# EasyEDA Pro project ProProject_个人时钟天气站_练习用_2024-06-15.epro

# Schematic 超漂亮的个人时钟天气站_备课

## Sheets
1 LCD_AND_MCU
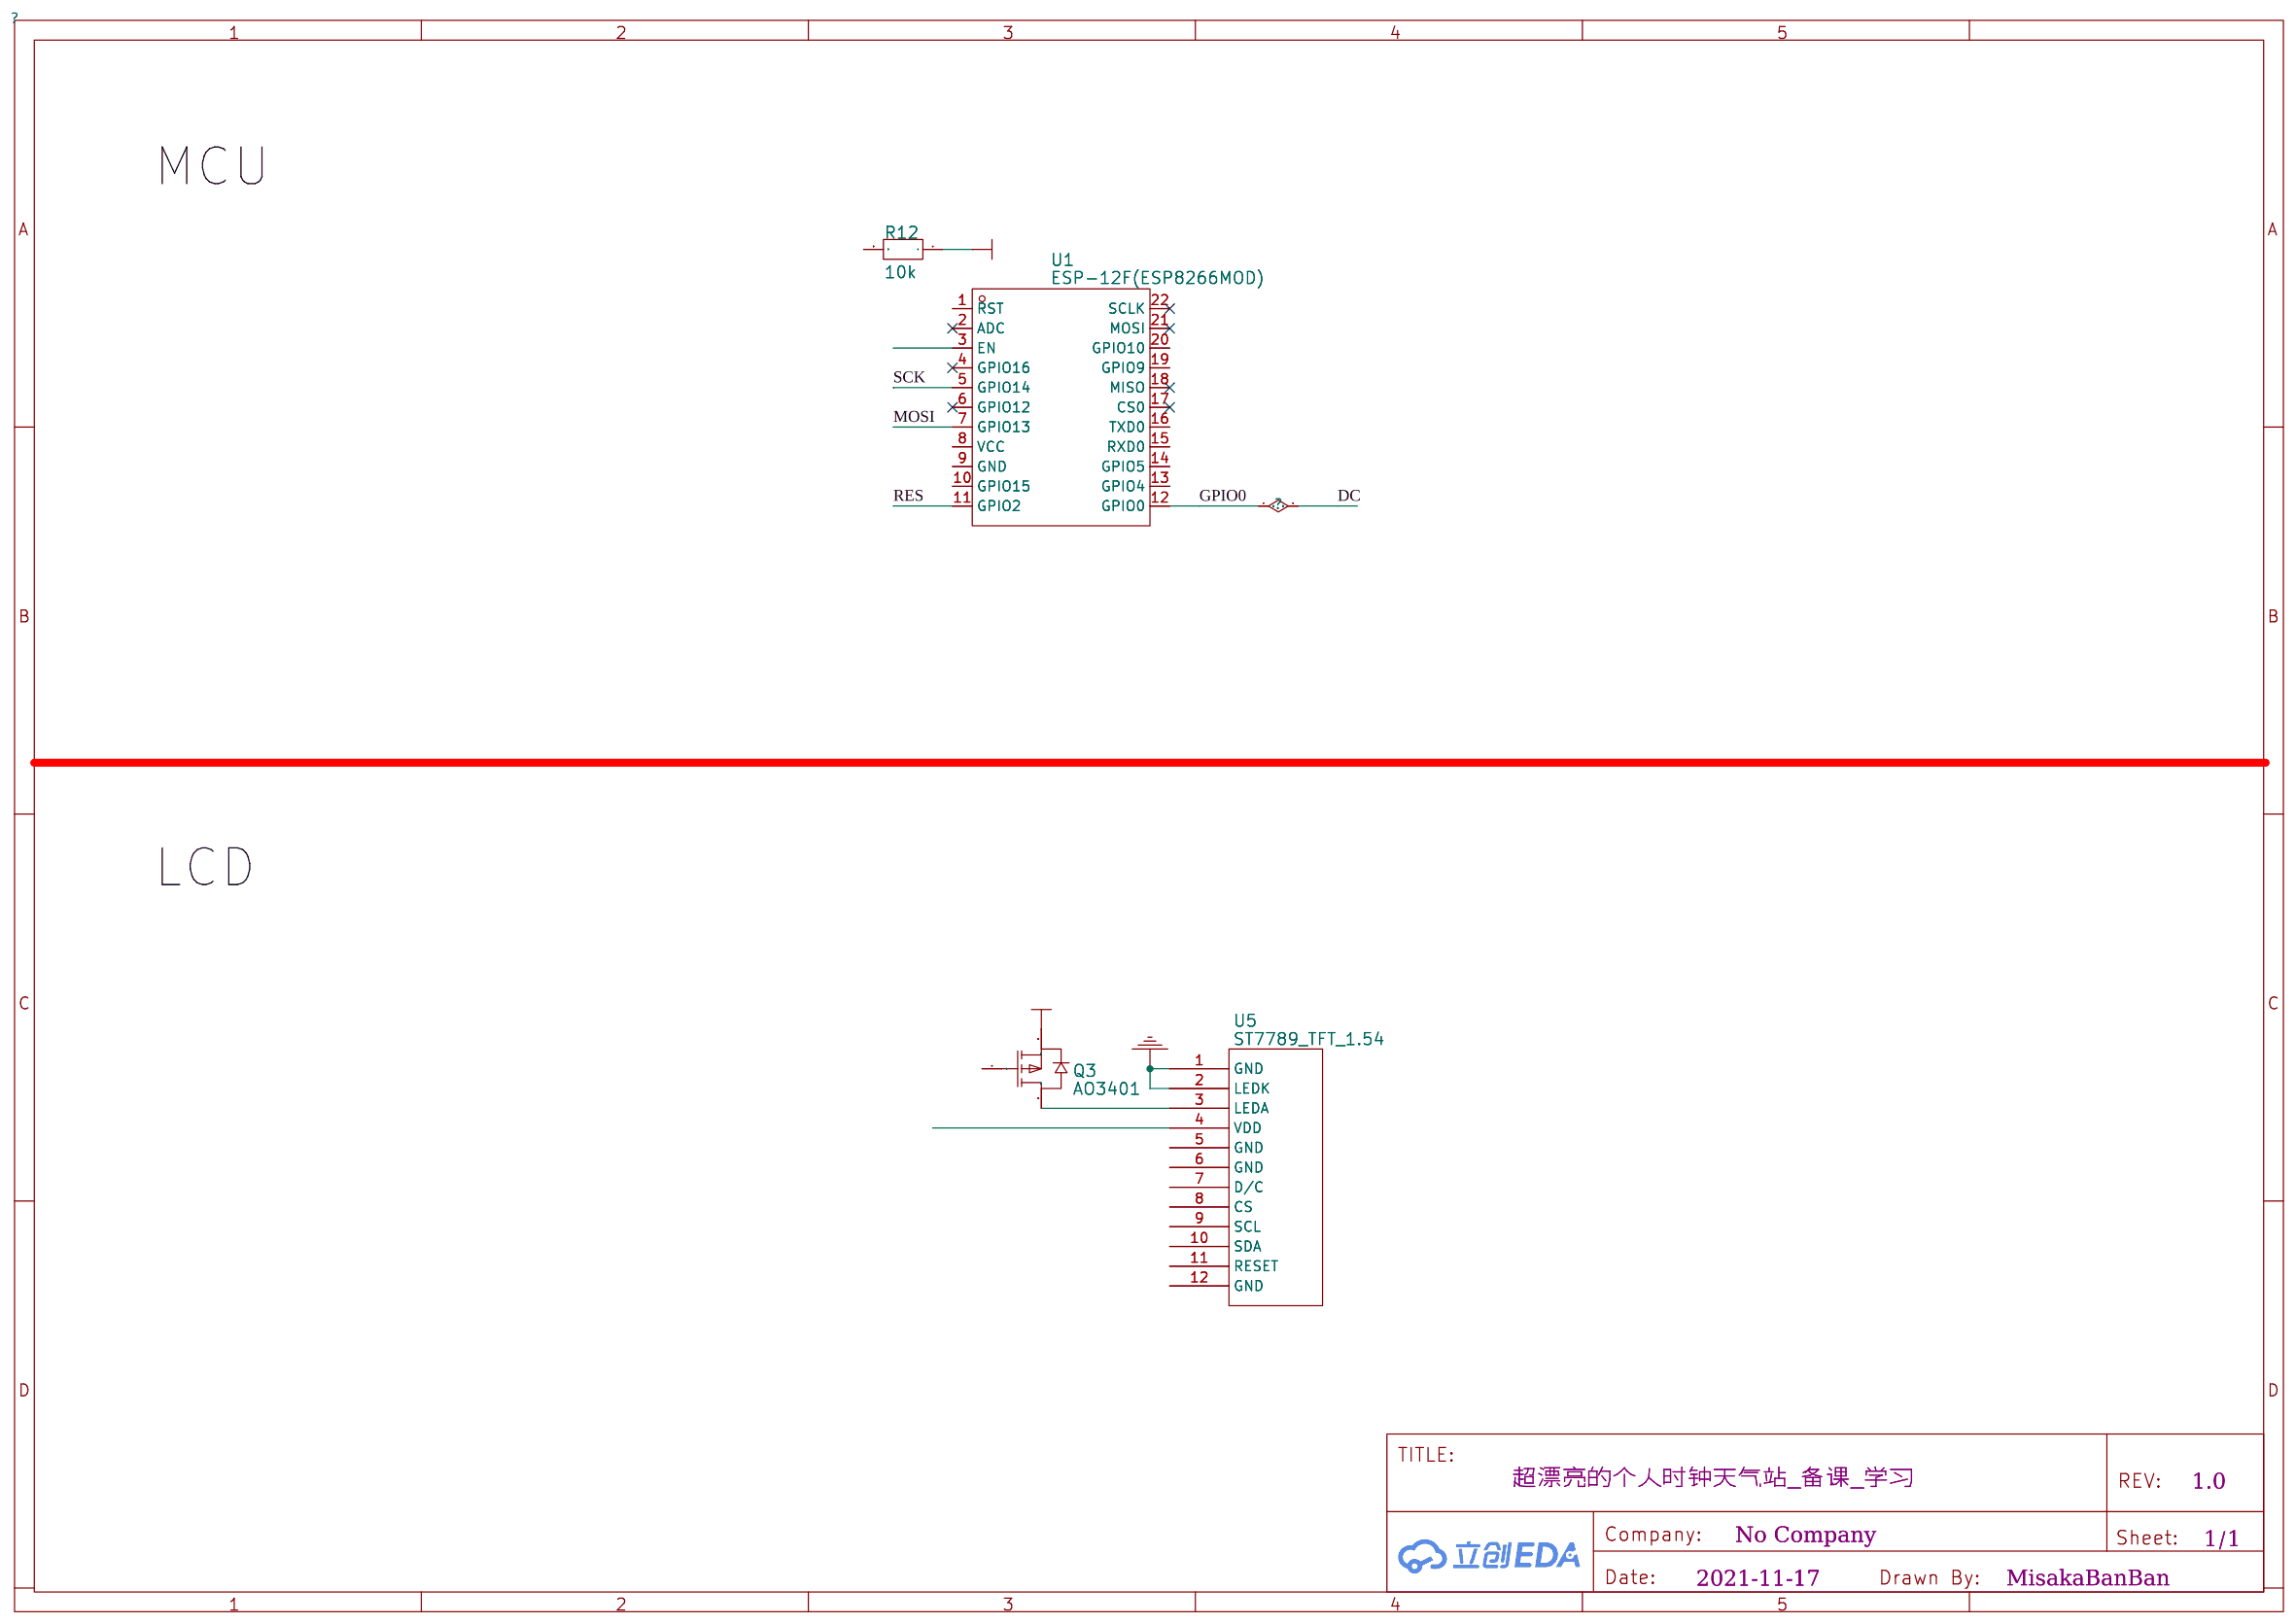
[diagram p0: LCD_AND_MCU]
2 USB_TO_UART
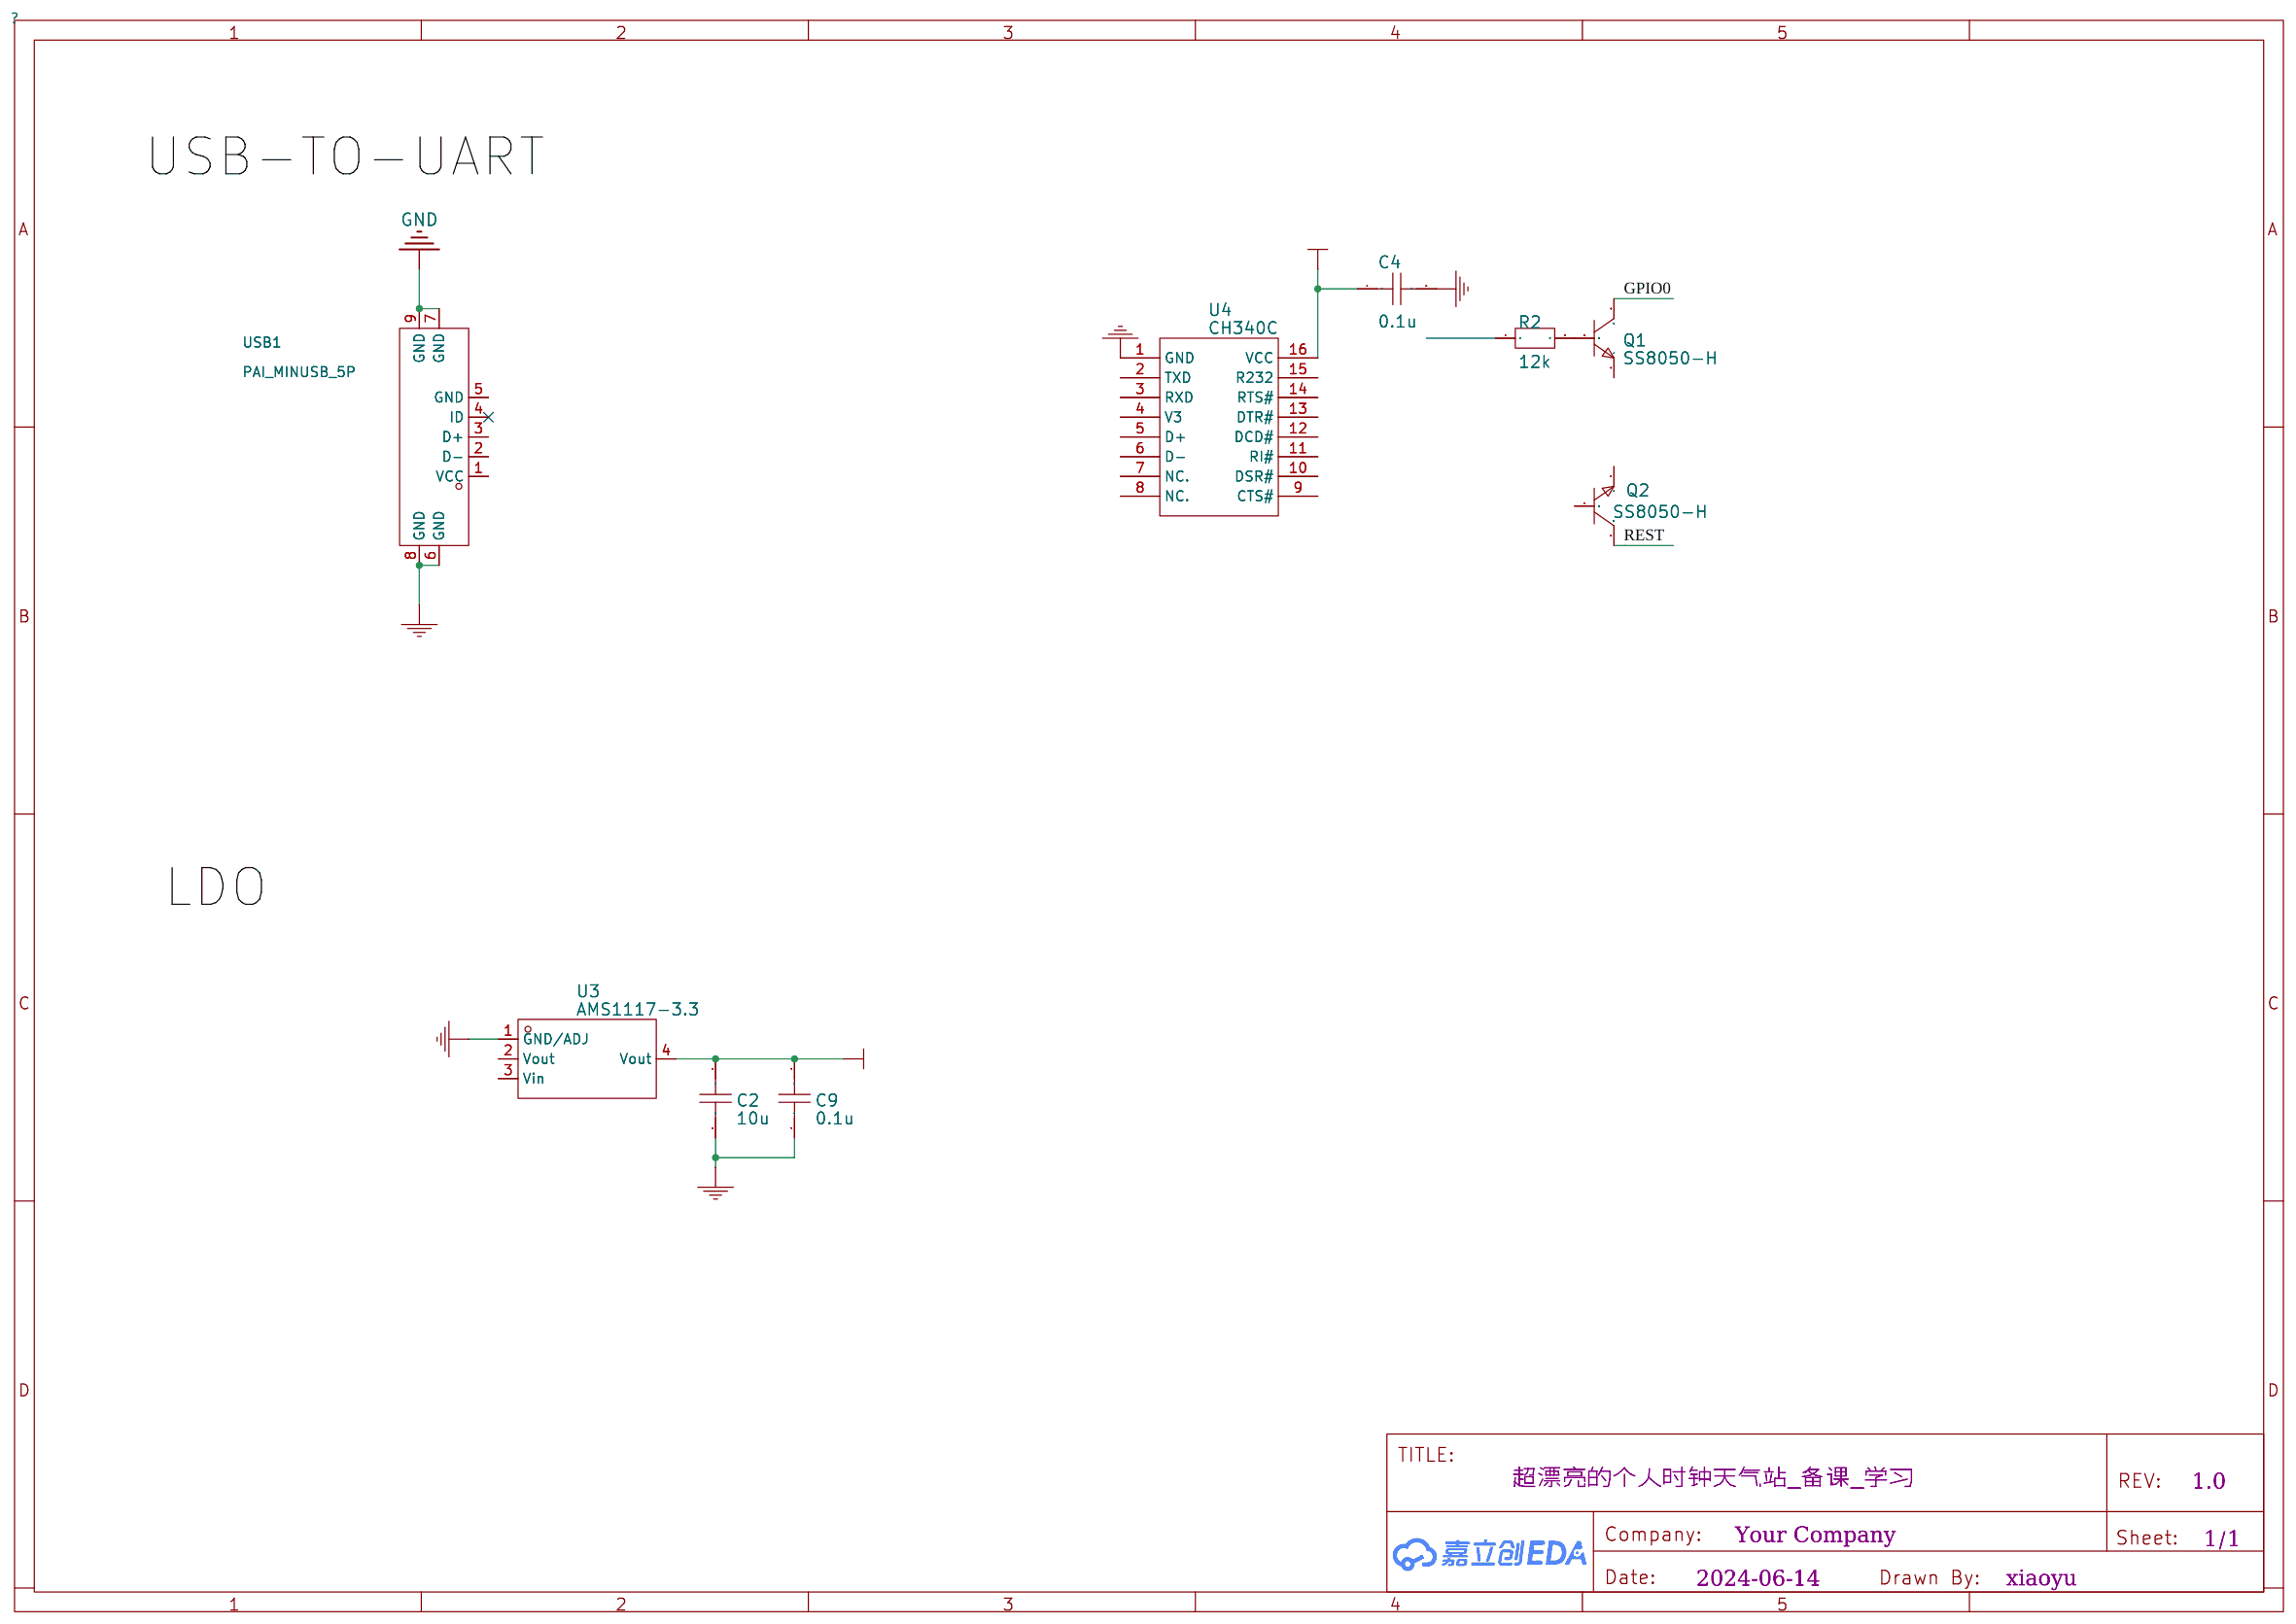
[diagram p1: USB_TO_UART]
3 Sheet_Structure
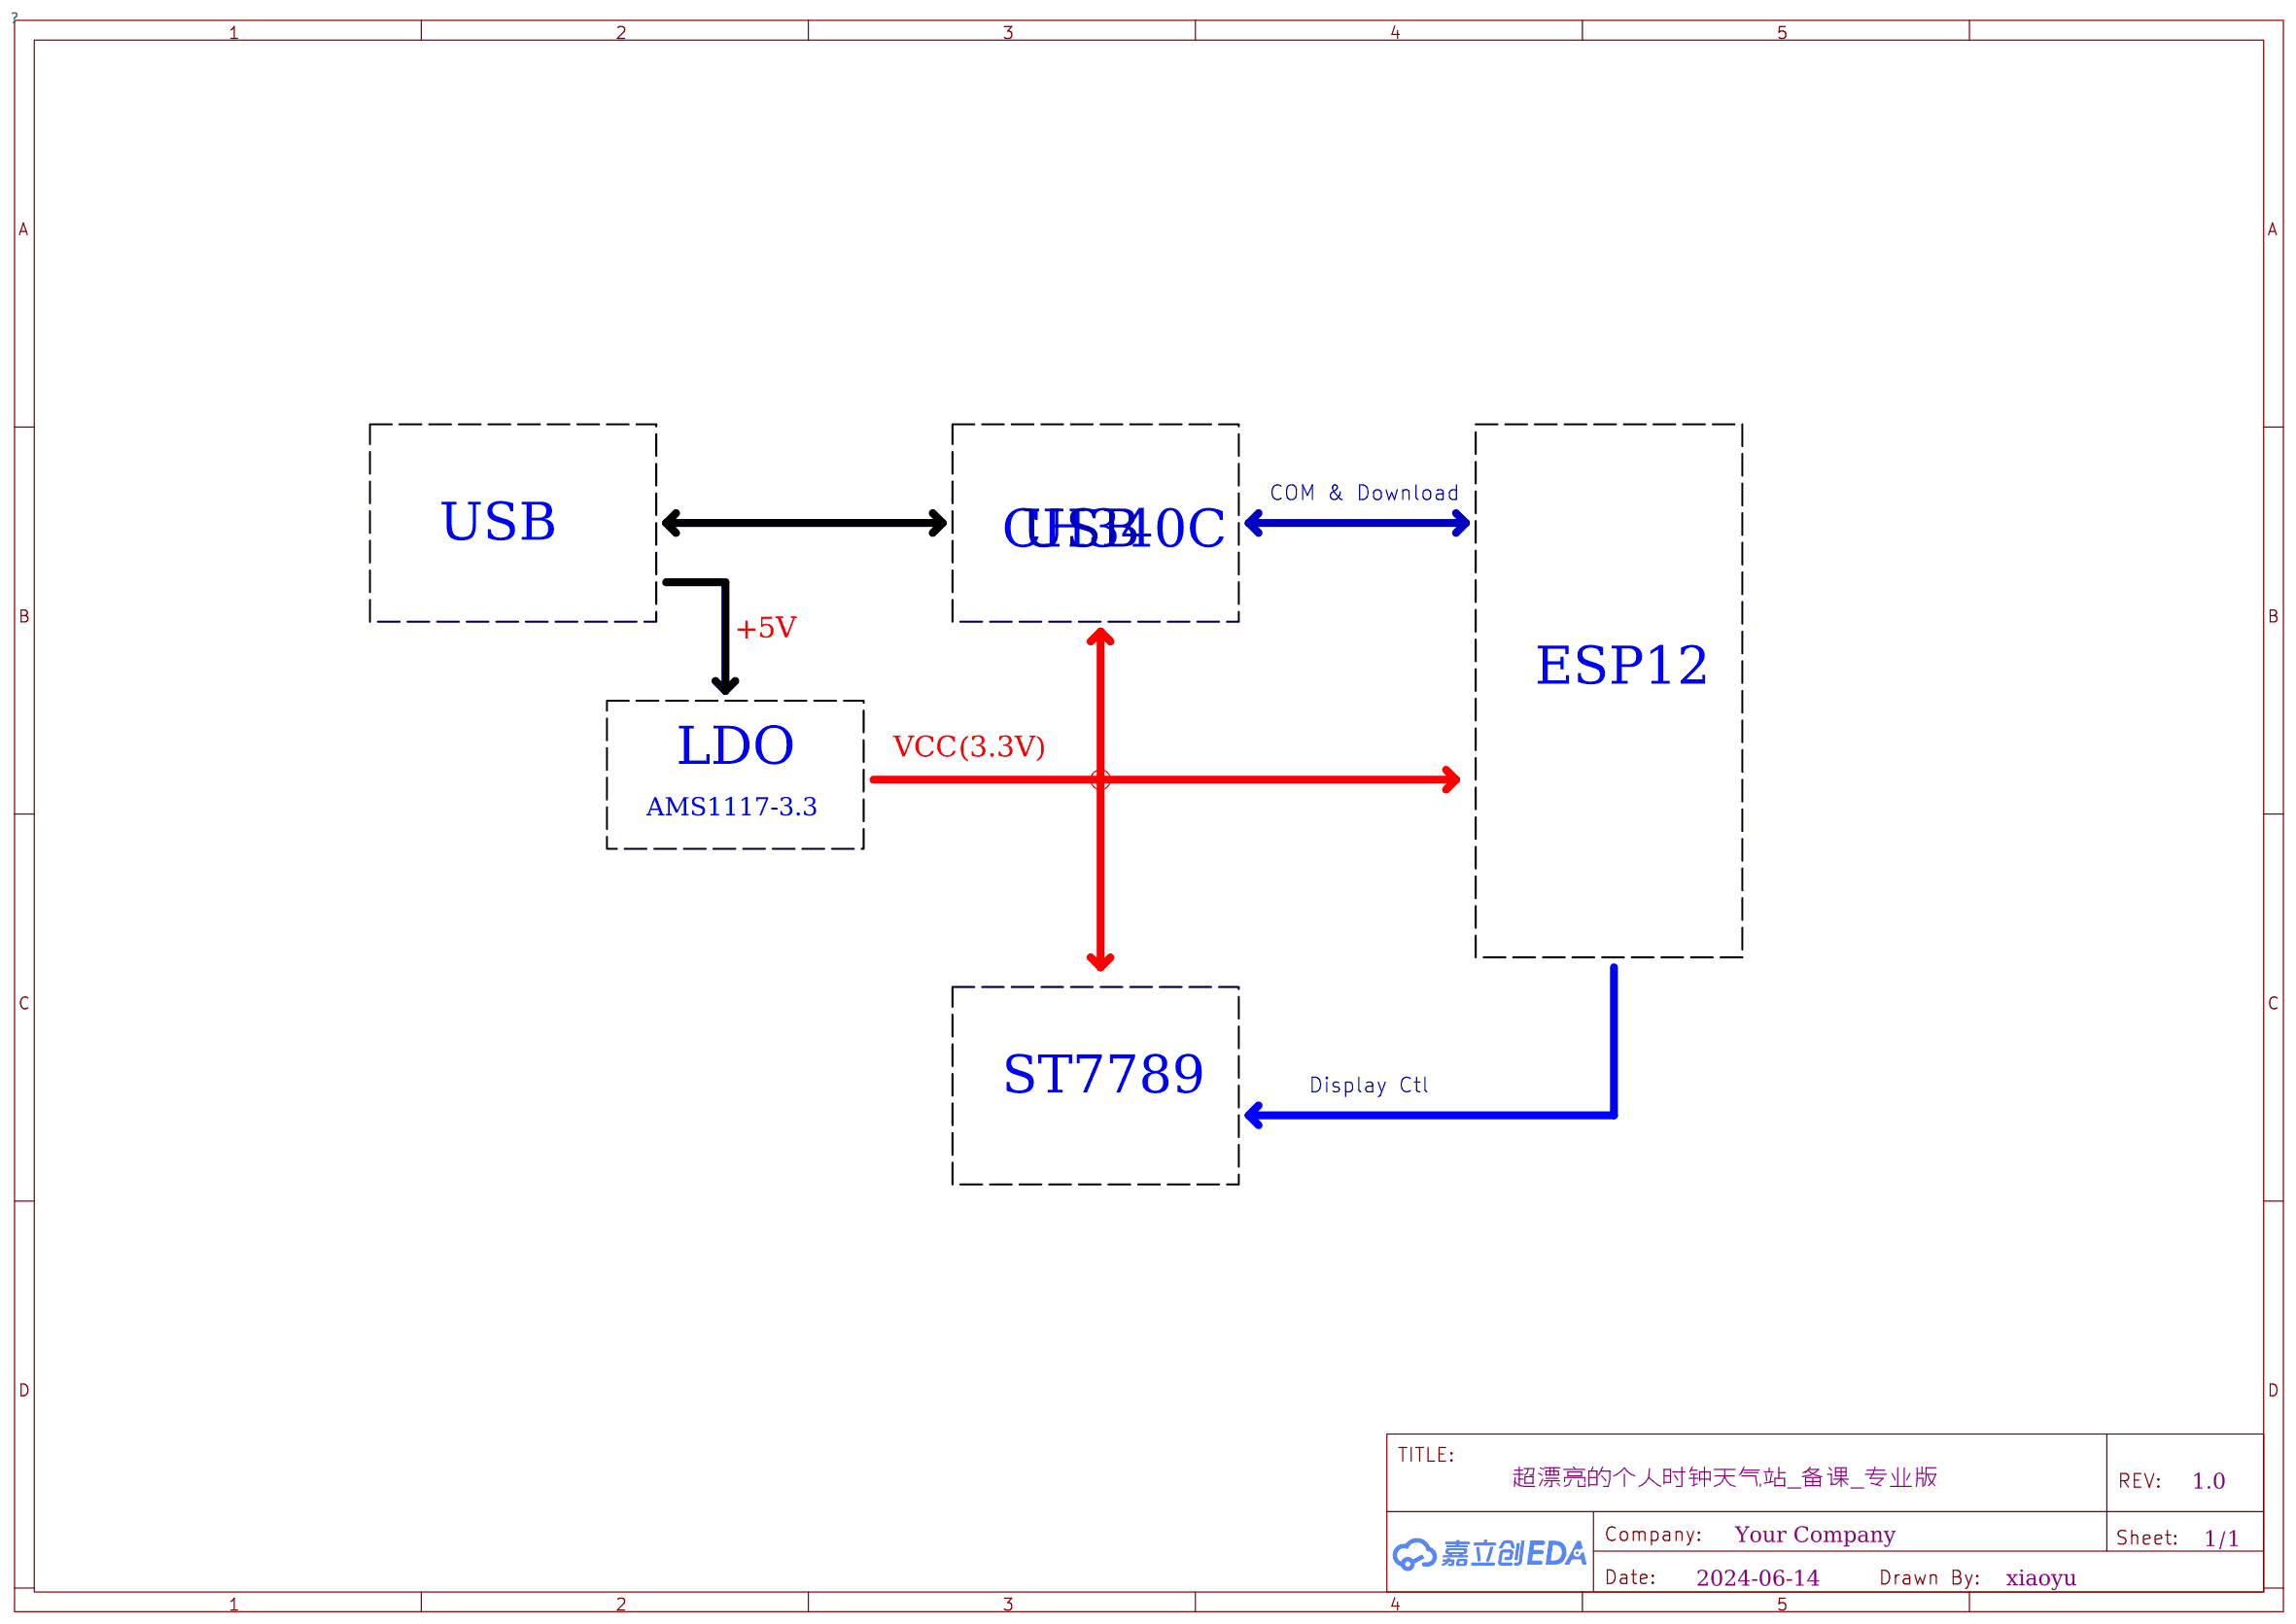
[diagram p2: Sheet_Structure]

## Parts
sheet LCD_AND_MCU
Q3  AO3401  [AO3401]
R12  10k  [R0603]
U1  ESP-12F(ESP8266MOD)  [WIFIM-SMD_ESP-12F-ESP8266MOD]
U5  ST7789_TFT_1.54  [ST7789_TFT_1.54]
sheet USB_TO_UART
C2  10u  [C0603]
C4  0.1u  [C0603]
C9  0.1u  [C0603]
Q1  SS8050-H  [SOT-23-3_L2.9-W1.3-P1.90-LS2.4-BR]
Q2  SS8050-H  [SOT-23-3_L2.9-W1.3-P1.90-LS2.4-BR]
R2  12k  [R0603]
U3  AMS1117-3.3  [SOT-223-3_L6.5-W3.4-P2.30-LS7.0-BR]
U4  CH340C  [SOP-16_L10.0-W3.9-P1.27-LS6.0-BL]
USB1  PAI_MINUSB_5P  [MINI-USB-SMD_PAI_MINUSB_5P]

## Library data of the parts
Q3 = AO3401: Manufacturer: LGE; Supplier: LCSC; Supplier Part: C688915; link: https://item.szlcsc.com/14454.html
R2 R12 = 12k
U1 = ESP-12F(ESP8266MOD): Supplier: LCSC; Manufacturer: Ai-Thinker; Supplier Part: C82891; JLCPCB Part Class: Extended Part
U5 = ST7789_TFT_1.54
C2 = 10u
C4 C9 = 0.1u
Q1 Q2 = SS8050-H: Supplier: LCSC; Supplier Part: C699255; Manufacturer: Yangzhou Yangjie Elec Tech; JLCPCB Part Class: Extended Part
U3 = AMS1117-3.3: Supplier: LCSC; Manufacturer: AMS; Supplier Part: C6186; JLCPCB Part Class: Basic Part
U4 = CH340C: Supplier: LCSC; Manufacturer: WCH; Supplier Part: C84681; JLCPCB Part Class: Extended Part
USB1 = PAI_MINUSB_5P: Supplier Part: C2889293; Supplier Footprint: USB-SMD_5P; JLCPCB Part Class: 扩展库; Supplier: LCSC

## Nets
GND: C2.2 C4.2 C9.2 U3.1(GND/ADJ) U4.1(GND) U5.1(GND) U5.2(LEDK) USB1.6(GND) USB1.7(GND) USB1.8(GND) USB1.9(GND)
VCC: C2.1 C4.1 C9.1 Q3.2(S) R12.1 U3.4(Vout) U4.16(VCC)
DC: Q1.3(C) U1.12(GPIO0)
MOSI: U1.7(GPIO13)
RES: U1.11(GPIO2)
REST: Q2.3(C)
SCK: U1.5(GPIO14)
Net-(Q1-1): Q1.1(B) R2.2
Net-(Q3-3): Q3.3(D) U5.3(LEDA)

Not connected (* = marked no-connect by the designer): Q1 2(E); Q2 1(B) 2(E); Q3 1(G); R2 1; R12 2; U1 1(RST) 2(ADC)* 3(EN) 4(GPIO16)* 6(GPIO12)* 8(VCC) 9(GND) 10(GPIO15) 13(GPIO4) 14(GPIO5) 15(RXD0) 16(TXD0) 17(CS0)* 18(MISO)* 19(GPIO9) 20(GPIO10) 21(MOSI)* 22(SCLK)*; U3 2(Vout) 3(Vin); U4 2(TXD) 3(RXD) 4(V3) 5(D+) 6(D-) 7(NC.) 8(NC.) 9(CTS#) 10(DSR#) 11(RI#) 12(DCD#) 13(DTR#) 14(RTS#) 15(R232); U5 4(VDD) 5(GND) 6(GND) 7(D/C) 8(CS) 9(SCL) 10(SDA) 11(RESET) 12(GND); USB1 1(VCC) 2(D-) 3(D+) 4(ID)* 5(GND)

## Notes on the sheets
sheet 1
- MCU
- LCD
sheet 2
- USB-TO-UART
- LDO
sheet 3
- COM & Download
- USB
- CH340C
- USB
- +5V
- ESP12
- LDO
- VCC(3.3V)
- AMS1117-3.3
- Display Ctl
- ST7789

# Board PCB_【征集令】超漂亮的个人时钟天气站
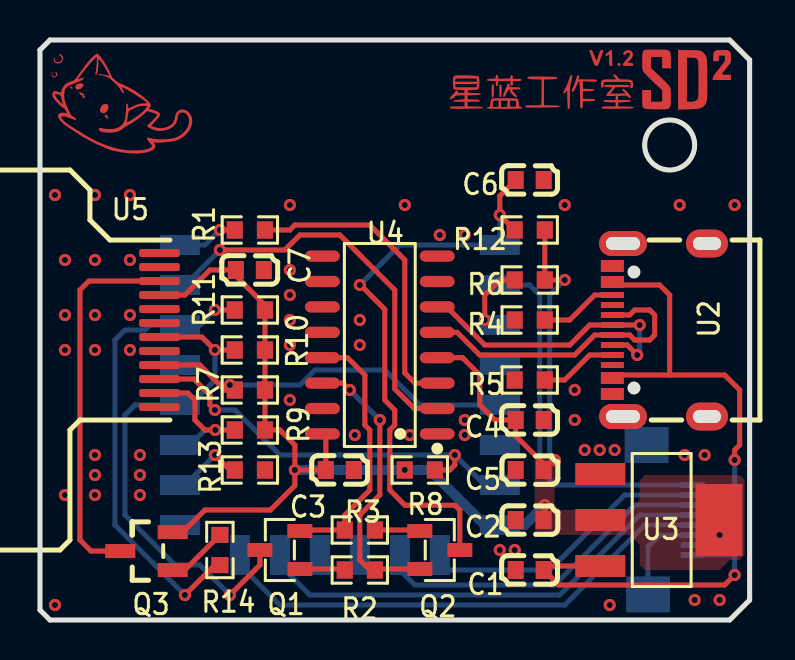
[diagram p3: board, top side]
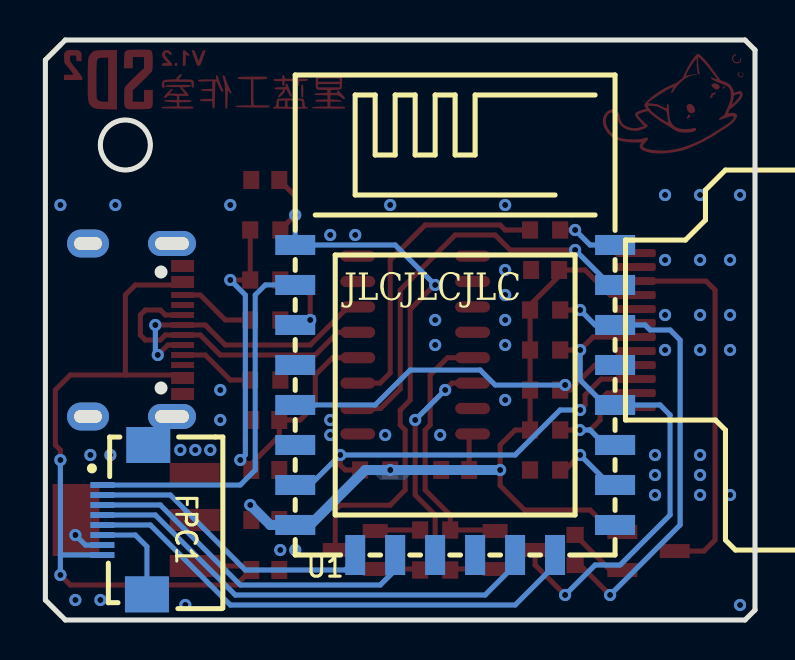
[diagram p4: board, bottom side, seen from below]

Outline 35.5 x 29 mm; copper layers: Top Layer, Inner1, Inner2, Inner3, Inner4, Inner5, Inner6, Inner7, Inner8, Inner9, Inner10, Inner11, Inner12, Inner13, Inner14, Inner15, Inner16, Inner17, Inner18, Inner19, Inner20, Inner21, Inner22, Inner23, Inner24, Inner25, Inner26, Inner27, Inner28, Inner29, Inner30, Bottom Layer. Coordinates in mm from the lower left corner of the outline.
Outline path: circle c31.5,23.75 r1.25 ; 0,28.5 0,0.5 0.5,0 34.5,0 35.5,1 35.5,28 34.5,29 0.5,29 0,28.5
Stack: Top Layer 0.035mm / Dielectric1 1.51mm FR4 er 4.5 / Bottom Layer 0.035mm

## Design rules (mm)
spacing 13: track to track 0.152, other pairs 0 to 0.152
spacing Default (default): track to track 0.152, other pairs 0 to 0.152
track width 13: min 0.2, default 0.2, max 25.4
track width Default (default): min 0.25, default 0.25, max 25.4
differential pair differentialPair (default): width min 0.127, default 0.254, max 2.54; gap min 0.152, default 0.152
via 13: diameter min 0.6, default 0.6, max 100.025; hole min 0.305, default 0.305, max 59.995
via Default (default): diameter min 0.6, default 0.6, max 100.025; hole min 0.305, default 0.305, max 59.995
net GND uses gge2591
pour e88 uses gge2588
pour e257 uses gge2591

## Placement (name value [footprint] x y rotation side)
C1  10u  [C0603]  24.5 2.5 0 top
C2  10u  [C0603]  24.5 5 180 top
C3  0.1u  [C0603]  15 7.5 0 top
C4  0.1u  [C0603]  24.5 10 0 top
C5  0.1u  [C0603]  24.5 7.5 180 top
C6  0.1u  [C0603]  24.5 22 0 top
C7  0.1u  [C0603]  10.5 17.5 0 top
FPC1  FPC0.5-8P COPY  [FPC-SMD_18P-P0.50_FPC0.5-8P]  31.5 2.5 270 bottom
Q1  SS8050-H  [SOT-23-3_L2.9-W1.3-P1.90-LS2.4-BR]  12 3.5 0 top
Q2  SS8050-H  [SOT-23-3_L2.9-W1.3-P1.90-LS2.4-BR]  20 3.5 180 top
Q3  -  [AO3401]  4.5 3.5 0 top
R1  200R  [R0603]  10.5 19.5 0 top
R2  12k  [R0603]  16 2.5 180 top
R3  12k  [R0603]  16 4.5 0 top
R4  5.1k  [R0603]  24.5 15 180 top
R5  5.1k  [R0603]  24.5 12 0 top
R6  12k  [R0603]  24.5 17 180 top
R7  12k  [R0603]  10.5 11.5 180 top
R8  12k  [R0603]  19 7.5 0 top
R9  12k  [R0603]  10.5 9.5 180 top
R10  12k  [R0603]  10.5 13.5 180 top
R11  12k  [R0603]  10.5 15.5 180 top
R12  12k  [R0603]  24.5 19.5 180 top
R13  12k  [R0603]  10.5 7.5 180 top
R14  1k  [R0603]  9 3.5 90 top
U1  ESP-12F(ESP8266MOD)  [WIFIM-SMD_ESP-12F-ESP8266MOD]  15 11 270 bottom
U2  TYPE-C16PIN母座 板上四脚三次MOLDING  [USB-SMD_TYPE-C16PIN]  31 14.5 90 top
U3  AMS1117-3.3  [SOT-223-3_L6.5-W3.4-P2.30-LS7.0-BR]  31 5 180 top
U4  CH340C  [SOP-16_L10.0-W3.9-P1.27-LS6.0-BL]  17 13.75 90 top
U5  -  [ST7789_TFT_1.54]  6.5 14.62 270 top

## Footprints (pads in the part's own frame, mm; a bottom-side part is the same pattern mirrored in y, then rotated)
AO3401
  rect 1.5x0.7 smd: 1(2.139,-1.003) 2(2.14,0.897) 3(-0.485,-0.053)
C0603
  rect 0.8x0.9 smd: 1(-0.7,0) 2(0.7,0)
FPC-SMD_18P-P0.50_FPC0.5-8P
  rect 0.3x1.2 smd: 1(-4.25,-1.15) 2(-3.749,-1.15) 3(-3.249,-1.15) 4(-2.749,-1.15) 5(-2.249,-1.15) 6(-1.75,-1.15) 7(-1.25,-1.15) 8(-0.75,-1.15)
  rect 1.8x2.2 smd: 9(1.219,1.081) 10(-6.25,1.15)
R0603
  rect 0.806x0.864 smd: 1(-0.753,0) 2(0.753,0)
SOP-16_L10.0-W3.9-P1.27-LS6.0-BL
  oval 0.56x1.745 smd: 1(-4.445,-2.873) 2(-3.175,-2.873) 3(-1.905,-2.873) 4(-0.635,-2.873) 5(0.635,-2.873) 6(1.905,-2.873) 7(3.175,-2.873) 8(4.445,-2.873) 9(4.445,2.873) 10(3.175,2.873) 11(1.905,2.873) 12(0.635,2.873) 13(-0.635,2.873) 14(-1.905,2.873) 15(-3.175,2.873) 16(-4.445,2.873)
SOT-23-3_L2.9-W1.3-P1.90-LS2.4-BR
  rect 1.25x0.7 smd: 1(1,-0.95) 2(1,0.95) 3(-1,0)
SOT-223-3_L6.5-W3.4-P2.30-LS7.0-BR
  rect 2.5x1.1 smd: 1(2.97,-2.3) 2(2.97,0) 3(2.97,2.3)
  rect 2.34x3.6 smd: 4(-2.97,0)
ST7789_TFT_1.54
  custom 0.4x2.032 smd: 1(-3.723,-0.521) 2(-3.023,-0.521) 3(-2.323,-0.521) 4(-1.623,-0.521) 5(-0.923,-0.521) 6(-0.223,-0.521) 7(0.477,-0.521) 8(1.177,-0.521) 9(1.877,-0.521) 10(2.577,-0.521) 11(3.277,-0.521) 12(3.977,-0.521)
USB-SMD_TYPE-C16PIN
  oval 1.25x2.4 hole 0.65x1.7: 17(-4.325,1.835) 18(4.325,1.835)
  oval 1.4x2.1 hole 0.65x1.4: 19(-4.325,-2.365) 20(4.325,-2.365)
  rect 0.3x1.15 smd: A1(-3.35,2.365) A4(-2.55,2.365) A5(-1.25,2.365) A6(-0.25,2.365) A7(0.25,2.365) A8(1.25,2.365) A9(2.55,2.365) A12(3.35,2.365) B1(3.05,2.365) B4(2.25,2.365) B5(1.75,2.365) B6(0.75,2.365) B7(-0.75,2.365) B8(-1.75,2.365) B9(-2.25,2.365) B12(-3.05,2.365)
WIFIM-SMD_ESP-12F-ESP8266MOD
  rect 1x2 smd: 1(-7.751,-8.002) 2(-5.751,-8.002) 3(-3.751,-8.002) 4(-1.751,-8.002) 5(0.249,-8.002) 6(2.249,-8.002) 7(4.25,-8.002) 8(6.25,-8.001) 9(6.25,7.998) 10(4.25,8.001) 11(2.249,8.002) 12(0.249,8.001) 13(-1.751,8) 14(-3.751,8.001) 15(-5.751,8.001) 16(-7.751,8.001)
  rect 2x1 smd: 17(7.75,-5) 18(7.749,-3.002) 19(7.75,-1.004) 20(7.75,0.998) 21(7.75,2.997) 22(7.75,4.997)

## Nets
+5V: C1.2 FPC1.8 U2.A4 U2.A9 U2.B4 U2.B9 U3.3
GND: C1.1 C2.2 C3.2 C4.2 C5.2 C6.2 C7.2 FPC1.6 FPC1.9 FPC1.10 R4.2 R5.1 R13.1 U1.9 U2.17 U2.18 U2.19 U2.20 U2.A1 U2.A12 U2.B1 U2.B12 U3.1 U4.1 U5.1 U5.2 U5.5 U5.6 U5.8 U5.12
VCC: C2.1 C3.1 C4.1 C5.1 C7.1 FPC1.7 Q3.2 R6.1 R7.1 R8.1 R9.1 R10.1 R11.1 R12.1 U1.8 U3.2 U3.4 U4.4 U4.16 U5.4
ADC: FPC1.1 U1.2
CS0: FPC1.2 U1.17
D+: U2.A6 U2.B6 U4.5
D-: U2.A7 U2.B7 U4.6
DTR: Q1.2 R3.1 U4.13
EN: R6.2 U1.3
GPIO0: Q1.3 R10.2 U1.12 U5.7
GPIO2: R9.2 U1.11 U5.11
GPIO5: R11.2 R14.1 U1.14
GPIO12: U1.6
GPIO13: R8.2 U1.7 U5.10
GPIO14: R7.2 U1.5 U5.9
GPIO15: R13.2 U1.10
GPIO16: U1.4
MISO0: FPC1.3 U1.18
MOSI0: FPC1.4 U1.21
Q1_1: Q1.1 R2.2
Q2_1: Q2.1 R3.2
Q3_1: Q3.1 R14.2
REST: C6.1 Q2.3 R12.2 U1.1
RTS: Q2.2 R2.1 U4.14
RXD: U1.15 U4.2
SCLK0: FPC1.5 U1.22
TXD: R1.1 U1.16
U2_A5: R5.2 U2.A5
U2_B5: R4.1 U2.B5
U4_3: R1.2 U4.3
U5_3: Q3.3 U5.3

Pads without a net: U1 13 19 20; U2 A8 B8; U4 7 8 9 10 11 12 15

## Via types
v1: diameter 0.61, hole 0.305, Top Layer to Bottom Layer, 76 vias

## Routing (per net, layer and track width the routed paths; a pad name or vN(x,y) marks a point on that pad's centre or on a via; arc(x,y) is an arc through that point)
+5V: length 38.8
  Top Layer w0.25: U2.B9 U2.A4 ; U2.B4 U2.A9
  Top Layer w0.254: U2.B9 31.5,12.25 ; 31.5,12.25 34.25,12.25 35,11.5 35,8.75 34.75,8.5 v1(34.75,8) ; 31.5,12.25 31.5,16.25 31,16.75 U2.B4 ; v1(34.75,2.25) 34.25,1.75 25.95,1.75 C1.2 25.4,2.7 U3.3
  Bottom Layer w0.254: FPC1.8 34.75,3.25 ; v1(34.75,8) v1(34.75,2.25)
GND: length 4.9
  Bottom Layer w0.25: FPC1.9 30.42,3.67 31,4.25 FPC1.6
  vias: v1(0.75,21.25) v1(0.75,0.75) v1(1.25,18) v1(1.25,15.25) v1(1.25,13.5) v1(1.25,6.25) v1(2.75,21.25) v1(2.75,18) v1(2.75,15.25) v1(2.75,13.5) v1(2.75,8.25) v1(2.75,7.25) v1(2.75,6.25) v1(4.5,21.25) v1(4.5,18) v1(4.5,15.25) v1(4.5,13.5) v1(5,8.25) v1(5,7.25) v1(5,6.25) v1(12.5,20.75) v1(12.5,17.5) v1(12.5,16.25) v1(12.5,15) v1(12.5,13.75) v1(12.5,11) v1(15.75,9.25) v1(16,15) v1(16,13.75) v1(18.25,20.75) v1(18.5,9.25) v1(20,19.25) v1(21.25,19.25) v1(21.25,10) v1(21.25,9.25) v1(23,3.5) v1(23.75,3.5) v1(26.25,20.75) v1(26.75,11.5) v1(26.75,10) v1(27.25,8.5) v1(28,8.5) v1(28.5,0.75) v1(28.75,8.5) v1(32,20.75) v1(32.25,8.25) v1(32.75,1) v1(33.25,8.25) v1(34,1) v1(34.75,20.75)
VCC: length 65
  Top Layer w0.25: R6.1 v1(26.25,17)
  Top Layer w0.254: R12.1 R6.1 ; U5.4 7.25,16.25 8.5,17.5 C7.1 9.8,17.2 11.25,15.75 R11.1 R10.1 R7.1 R9.1 ; U4.4 21.13,13.11 22,12.25 22,10.75 22.75,10 C4.1 23.8,9.2 25.2,7.8 C5.1 ; 12.75,7.5 C3.1 14.3,9.13 U4.16 ; Q3.2 7.15,4.4 8.25,5.5 11.53,5.5 12.75,6.72 v1(12.75,7.5) 12.75,8.75 12,9.5 11.25,9.5
  Bottom Layer w0.25: v1(34,4.25) 33.5,3.75 FPC1.7 ; 26.25,17 25.5,16.25 25.5,8.25 v1(25.75,8)
  Bottom Layer w0.5: v1(12.75,7.5) v1(18.25,7.5) ; 18.25,7.5 19.5,7.5 22.25,4.75 24.25,4.75 v1(25.25,5.75)
ADC: length 18.9
  Bottom Layer w0.25: U1.2 24.5,16.75 25,16.25 25,7.5 25.75,6.75 32.65,6.75
CS0: length 14.7
  Bottom Layer w0.254: 32.65,6.25 29.25,6.25 25.5,2.5 20.5,2.5 20,3 20,3.25
D+: length 15.3
  Top Layer w0.254: U2.B6 29.5,15.25 29.75,15.5 30.5,15.5 30.75,15.25 30.75,14.25 30.5,14 29.75,14 29.5,14.25 U2.A6 27.75,14.25 26.75,13.25 22,13.25 20.87,14.38 U4.5
D-: length 14.5
  Top Layer w0.254: 28.64,13.75 29.38,13.75 v1(29.88,13.25) 30,13.25 ; 19.87,15.65 20.35,15.65 22.25,13.75 26.5,13.75 27.5,14.75 U2.A7 v1(30,14.75)
  Bottom Layer w0.254: v1(30,14.75) 30,13.38 v1(29.88,13.25)
DTR: length 13.1
  Top Layer w0.254: Q1.2 13.05,4.5 R3.1 ; 14.13,13.11 15.38,13.11 16.25,12.25 16.25,9.75 16.5,9.5 16.5,6.5 15.25,5.25 15.25,4.5
EN: length 3.9
  Top Layer w0.25: 23.75,17 23,17 22.25,16.25 v1(22.25,15)
  Bottom Layer w0.25: v1(22.25,15) 22.75,15 23,14.75
GPIO0: length 25.5
  Top Layer w0.254: 9.75,13.5 v1(8.75,13.5) 8.1,14.15 U5.7 ; v1(9.5,1.25) 11,2.75 Q1.3
  Bottom Layer w0.254: v1(9.5,1.25) 8,2.75 6.75,2.75 4.25,5.25 4.25,10.25 4.75,10.75 U1.12 7.5,10.75 8.75,12 v1(8.75,13.5)
GPIO2: length 7.2
  Top Layer w0.254: 9.75,9.5 v1(8.77,9.5) 8.25,9.5 7.75,10 7.75,11 7.4,11.35 U5.11
  Bottom Layer w0.254: U1.11 7.5,8.75 8.25,9.5 v1(8.77,9.5)
GPIO5: length 23.2
  Top Layer w0.254: v1(7.25,1.25) 8.75,2.75 R14.1 ; 9.75,15.5 v1(8.75,15.5)
  Bottom Layer w0.254: v1(8.75,15.5) 8,14.75 7,14.75 5.5,14.75 5.25,14.5 4.25,14.5 3.75,14 3.75,4.75 7.25,1.25
GPIO13: length 21.1
  Top Layer w0.254: v1(8.75,10.5) 8.5,10.75 8.5,11.25 7.7,12.05 U5.10 ; 19.75,7.5 20.5,7.5 20.75,7.75 v1(20.75,8.25)
  Bottom Layer w0.254: 23,6.75 22.25,6.75 v1(20.75,8.25) 12,8.25 9.75,10.5 v1(8.75,10.5)
GPIO14: length 18.8
  Top Layer w0.254: 9.75,11.5 9.25,11.5 8,12.75 U5.9
  Bottom Layer w0.25: 23,10.75 19,10.75 17.25,12.5 13.75,12.5 13,11.75 v1(9.5,11.75)
GPIO15: length 3.7
  Top Layer w0.254: v1(8.75,8.25) 9.5,7.5 9.75,7.5
  Bottom Layer w0.254: v1(8.75,8.25) 7.25,6.75 7,6.75
MISO0: length 17.4
  Bottom Layer w0.254: 32.65,5.75 29.75,5.75 25.75,1.75 18.75,1.75 18,2.5 18,3.25
MOSI0: length 23.4
  Bottom Layer w0.254: 32.65,5.25 30,5.25 26,1.25 13.5,1.25 12,2.75 12,3.25
Q1_1: length 2.3
  Top Layer w0.254: 15.25,2.5 15.2,2.55 Q1.1
Q2_1: length 2.3
  Top Layer w0.254: 16.75,4.5 18.95,4.5 Q2.1
Q3_1: length 3.1
  Top Layer w0.254: Q3.1 7.24,2.5 R14.2
REST: length 29.5
  Top Layer w0.254: v1(23,20.25) 23,21.2 C6.1 ; 23.75,19.5 23,20.25 ; 16,16.75 16.03,16.75 17.25,15.53 17.25,11 17.75,10.49 17.75,9.75 17.5,9.5 17.5,6.5 18.25,5.74 20.75,5.74 21,5.5 21,3.5
  Bottom Layer w0.25: v1(23,20.25) 23,18.75
  Bottom Layer w0.254: v1(16,16.75) 18,18.75 23,18.75
RTS: length 14.3
  Top Layer w0.254: v1(17,10) 17,6.25 16,5.25 16,3 16.5,2.5 R2.1 16.8,2.55 Q2.2 ; v1(15.5,11.5) 15.16,11.84 U4.14
  Bottom Layer w0.254: v1(15.5,11.5) v1(17,10)
RXD: length 20.4
  Top Layer w0.254: 19.87,10.57 18.73,10.57 17.75,11.55 17.75,16.5 15,19.25 13,19.25 12.25,18.5 v1(9,18.5)
  Bottom Layer w0.254: v1(9,18.5) 7.25,16.75 7,16.75
SCLK0: length 25.6
  Bottom Layer w0.254: 32.65,4.75 30.25,4.75 26.25,0.75 12,0.75 10,2.75 10,3.25
TXD: length 3.1
  Top Layer w0.254: R1.1 v1(9,19.5)
  Bottom Layer w0.254: v1(9,19.5) 8.25,18.75 7,18.75
U2_A5: length 3.9
  Top Layer w0.254: U2.A5 27.5,13.25 26.25,12 25.25,12
U2_B5: length 3.9
  Top Layer w0.254: U2.B5 27.75,16.25 26.5,15 R4.1
U4_3: length 15.3
  Top Layer w0.254: R1.2 12.5,19.5 12.75,19.75 16.5,19.75 18.25,18 18.25,12.35 18.76,11.84 U4.3
U5_3: length 18.9
  Top Layer w0.254: U5.3 2.45,16.95 2,16.5 2,4 2.55,3.45 Q3.3

## Copper pours and planes (outline as drawn; the poured copper is in the pictures)
GND on Top Layer: 0,21.75 21.5,21.75 22.75,23 35.5,23 35.5,1 34.5,0 0.5,0 0,0.5
GND on Bottom Layer: 35.5,1 34.5,0 0.5,0 0,0.5 0,21.75 21.5,21.75 22.75,23 35.5,23
VCC on Top Layer: 24.75,8.25 35.25,8.25 35.25,2.5 24.75,2.5
VCC on Bottom Layer: 17,7.5 19,7.5 19,7 17,7

Small or netless copper shapes (teardrops, artwork), in the pictures only: 26 on Top Layer

## Text on the board
Bottom Silkscreen Layer: JLCJLCJLC
